# Altium schematic sheet MCU.SchDoc
size B; SheetNumber: 3; SheetTotal: 8
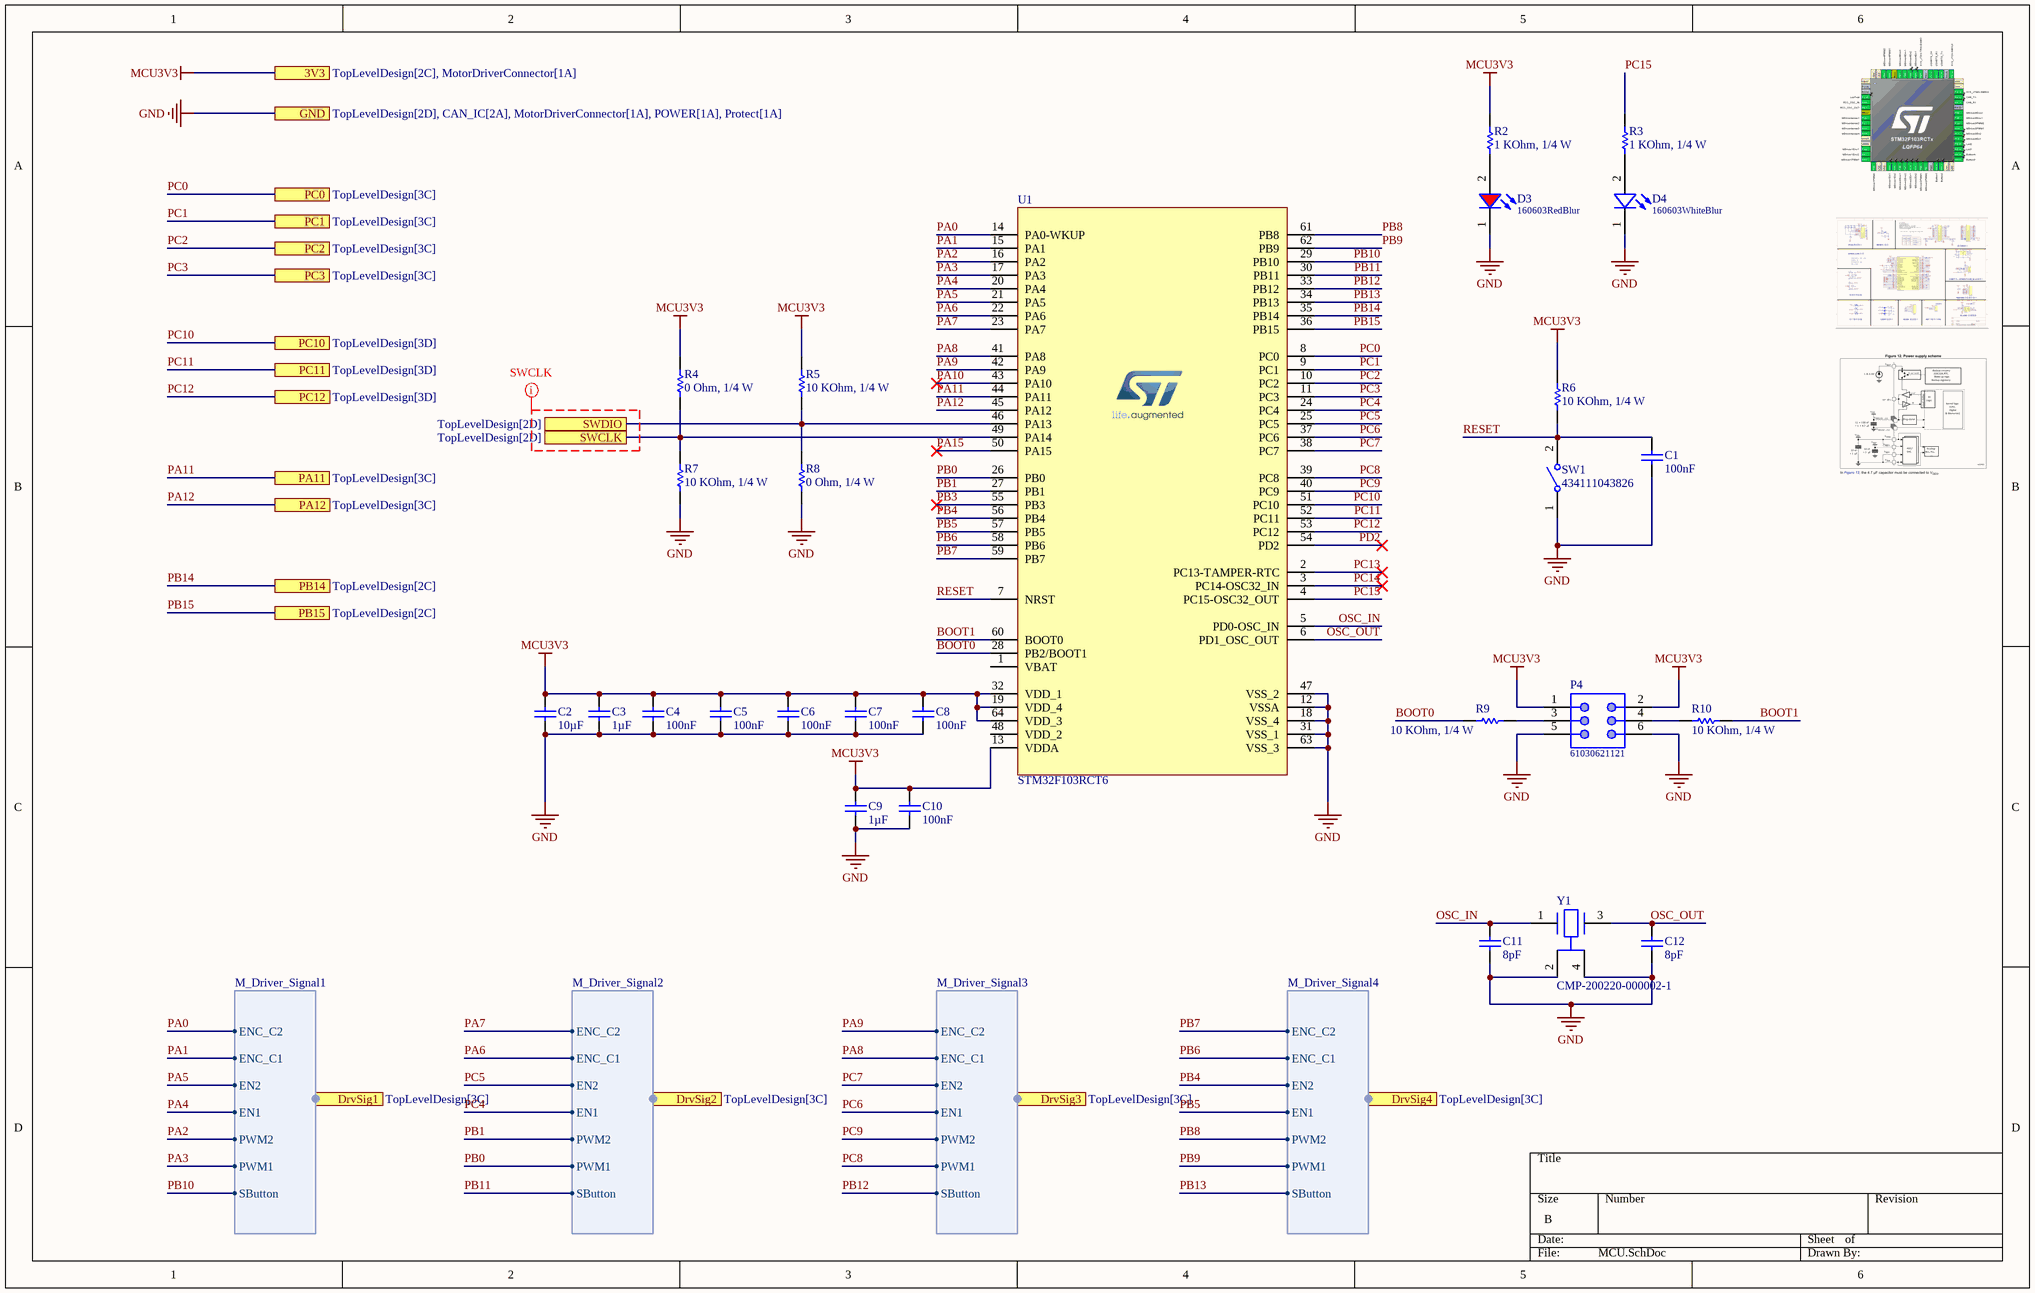
[diagram p0: MCU.SchDoc]

## Parts
C1  value 100nF  [CAP_0603]  (hidden comment: 0106031041050)
C2  value 10µF  [CAP_0603]  (hidden comment: 0106031061010)
C3  value 1µF  [CAP_0603]  (hidden comment: 0106031051016)
C4  value 100nF  [CAP_0603]  (hidden comment: 0106031041050)
C5  value 100nF  [CAP_0603]  (hidden comment: 0106031041050)
C6  value 100nF  [CAP_0603]  (hidden comment: 0106031041050)
C7  value 100nF  [CAP_0603]  (hidden comment: 0106031041050)
C8  value 100nF  [CAP_0603]  (hidden comment: 0106031041050)
C9  value 1µF  [CAP_0603]  (hidden comment: 0106031051016)
C10  value 100nF  [CAP_0603]  (hidden comment: 0106031041050)
C11  value 8pF  [CAP_0603]  (hidden comment: 0106030800550)
C12  value 8pF  [CAP_0603]  (hidden comment: 0106030800550)
D3  160603RedBlur  [WL-SMCW_0603_H=0.7mm]
D4  160603WhiteBlur  [WL-SMCW_0603_H=0.7mm]
P4  61030621121  [61030621121]
R2  value 1 KOhm, 1/4 W  [resistor_0603]  (hidden comment: 0006031021)
R3  value 1 KOhm, 1/4 W  [resistor_0603]  (hidden comment: 0006031021)
R4  value 0 Ohm, 1/4 W  [resistor_0603]  (hidden comment: 0006030001)
R5  value 10 KOhm, 1/4 W  [resistor_0603]  (hidden comment: 0006031031)
R6  value 10 KOhm, 1/4 W  [resistor_0603]  (hidden comment: 0006031031)
R7  value 10 KOhm, 1/4 W  [resistor_0603]  (hidden comment: 0006031031)
R8  value 0 Ohm, 1/4 W  [resistor_0603]  (hidden comment: 0006030001)
R9  value 10 KOhm, 1/4 W  [resistor_0603]  (hidden comment: 0006031031)
R10  value 10 KOhm, 1/4 W  [resistor_0603]  (hidden comment: 0006031031)
SW1  434111043826  [WS-TASV_L6W3.5H4.3_4341x10438x6]
U1  STM32F103RCT6  [QFP50P1200X1200X160-64N]
Y1  CMP-200220-000002-1  [FP-NX3225SA-MFG]

## Ports
3V3 (see TopLevelDesign[2C], MotorDriverConnector[1A]), DrvSig1 (harness M_Driver_Signal1, see TopLevelDesign[3C]), DrvSig2 (harness M_Driver_Signal2, see TopLevelDesign[3C]), DrvSig3 (harness M_Driver_Signal3, see TopLevelDesign[3C]), DrvSig4 (harness M_Driver_Signal4, see TopLevelDesign[3C]), GND (see TopLevelDesign[2D], CAN_IC[2A], MotorDriverConnector[1A], POWER[1A], Protect[1A]), PA11 (see TopLevelDesign[3C]), PA12 (see TopLevelDesign[3C]), PB14 (see TopLevelDesign[2C]), PB15 (see TopLevelDesign[2C]), PC0 (see TopLevelDesign[3C]), PC1 (see TopLevelDesign[3C]), PC2 (see TopLevelDesign[3C]), PC3 (see TopLevelDesign[3C]), PC10 (see TopLevelDesign[3D]), PC11 (see TopLevelDesign[3D]), PC12 (see TopLevelDesign[3D]), SWCLK (see TopLevelDesign[2D]), SWDIO (see TopLevelDesign[2D])

## Harnesses
M_Driver_Signal1: ENC_C2, ENC_C1, EN2, EN1, PWM2, PWM1, SButton
M_Driver_Signal2: ENC_C2, ENC_C1, EN2, EN1, PWM2, PWM1, SButton
M_Driver_Signal3: ENC_C2, ENC_C1, EN2, EN1, PWM2, PWM1, SButton
M_Driver_Signal4: ENC_C2, ENC_C1, EN2, EN1, PWM2, PWM1, SButton

## Nets
GND: C1.1 C2.1 C3.1 C4.1 C5.1 C6.1 C7.1 C8.1 C9.1 C10.1 C11.1 C12.1 D3.1(K) D4.1(K) P4.5 P4.6 R7.1 R8.1 SW1.1 U1.12(VSSA) U1.18(VSS_4) U1.31(VSS_1) U1.47(VSS_2) U1.63(VSS_3) Y1.2(GND) Y1.4(GND) ; port GND
MCU3V3: C2.2 C3.2 C4.2 C5.2 C6.2 C7.2 C8.2 C9.2 C10.2 P4.1 P4.2 R2.2 R4.2 R5.2 R6.2 U1.13(VDDA) U1.19(VDD_4) U1.32(VDD_1) U1.64(VDD_3) ; port 3V3
BOOT0: R9.1 U1.28(PB2/BOOT1)
BOOT1: R10.1 U1.60(BOOT0)
OSC_IN: C11.2 U1.5(PD0-OSC_IN) Y1.1
OSC_OUT: C12.2 U1.6(PD1_OSC_OUT) Y1.3
PA0: U1.14(PA0-WKUP) ; port DrvSig1.ENC_C2
PA1: U1.15(PA1) ; port DrvSig1.ENC_C1
PA2: U1.16(PA2) ; port DrvSig1.PWM2
PA3: U1.17(PA3) ; port DrvSig1.PWM1
PA4: U1.20(PA4) ; port DrvSig1.EN1
PA5: U1.21(PA5) ; port DrvSig1.EN2
PA6: U1.22(PA6) ; port DrvSig2.ENC_C1
PA7: U1.23(PA7) ; port DrvSig2.ENC_C2
PA8: U1.41(PA8) ; port DrvSig3.ENC_C1
PA9: U1.42(PA9) ; port DrvSig3.ENC_C2
PA10: U1.43(PA10)
PA11: U1.44(PA11) ; port PA11
PA12: U1.45(PA12) ; port PA12
PA15: U1.50(PA15)
PB0: U1.26(PB0) ; port DrvSig2.PWM1
PB1: U1.27(PB1) ; port DrvSig2.PWM2
PB3: U1.55(PB3)
PB4: U1.56(PB4) ; port DrvSig4.EN2
PB5: U1.57(PB5) ; port DrvSig4.EN1
PB6: U1.58(PB6) ; port DrvSig4.ENC_C1
PB7: U1.59(PB7) ; port DrvSig4.ENC_C2
PB8: U1.61(PB8) ; port DrvSig4.PWM2
PB9: U1.62(PB9) ; port DrvSig4.PWM1
PB10: U1.29(PB10) ; port DrvSig1.SButton
PB11: U1.30(PB11) ; port DrvSig2.SButton
PB12: U1.33(PB12) ; port DrvSig3.SButton
PB13: U1.34(PB13) ; port DrvSig4.SButton
PB14: U1.35(PB14) ; port PB14
PB15: U1.36(PB15) ; port PB15
PC0: U1.8(PC0) ; port PC0
PC1: U1.9(PC1) ; port PC1
PC2: U1.10(PC2) ; port PC2
PC3: U1.11(PC3) ; port PC3
PC4: U1.24(PC4) ; port DrvSig2.EN1
PC5: U1.25(PC5) ; port DrvSig2.EN2
PC6: U1.37(PC6) ; port DrvSig3.EN1
PC7: U1.38(PC7) ; port DrvSig3.EN2
PC8: U1.39(PC8) ; port DrvSig3.PWM1
PC9: U1.40(PC9) ; port DrvSig3.PWM2
PC10: U1.51(PC10) ; port PC10
PC11: U1.52(PC11) ; port PC11
PC12: U1.53(PC12) ; port PC12
PC13: U1.2(PC13-TAMPER-RTC)
PC14: U1.3(PC14-OSC32_IN)
PC15: R3.2 U1.4(PC15-OSC32_OUT)
PD2: U1.54(PD2)
RESET: C1.2 R6.1 SW1.2 U1.7(NRST)
SWCLK: R4.1 R7.2 U1.49(PA14) ; port SWCLK
SWDIO: R5.1 R8.2 U1.46(PA13) ; port SWDIO
NetD3_2: D3.2(A) R2.1
NetD4_2: D4.2(A) R3.1
NetP4_3: P4.3 R9.2
NetP4_4: P4.4 R10.2

Not connected (* = marked no-connect by the designer): U1 1(VBAT) 48(VDD_2)

## Layout directives
rule Matched Net Lengths [Delay Tolerance = 10ps]: (no net found under the mark)

## Library data of the parts
C1 C4-C8 C10 = CMP-001-00214-1: CAP, size 0603, 100 nF, 50 VDC; Manufacture SN: CGA3E3X8R1H104K080AE; Manufacture Name: TDK; Tolerance: 10%; Voltage Rating DC: 50 VDC; Supplier 2 Name: Digi-Key; Pins: 2; Supplier 3 Name: thegioiic; Design Item ID: 0106031041050; Supplier 1 Name: Mouser; Supplier 1 URL: https://www.mouser.com/ProductDetail/TDK/CGA3E3X8R1H104K080AE?qs=nQSIdc08i%252Bd8g3IRRgU2bw%3D%3D&utm_source=mouser-refine-download&utm_medium=file&utm_campaign=CGA3E3X8R1H104K080AE&utm_content=TDK; Size: 0603; Supplier 2 URL: https://www.digikey.com/en/products/detail/tdk-corporation/cga3e3x8r1h104k080ae/5809262; Operating Temperature: -55 to +125degC; Packaging: Tape and Reel; Source: Capacitor_0603_10_percent.SchLib; Supplier 1 SN: 810-CGA3E3X8R1H104KA; Supplier 3 SN: N/A; Supplier 2 SN: 445-173697-2-ND; Mounting Technology: SMT; Supplier 3 URL: N/A; Component Type: Standard
C2 = CMP-001-00219-1: CAP, size 0603, 10 uF, 10 VDC; Manufacture Name: Samsung Electro-Mechanics; Manufacture SN: CL10A106KP8NNWC; Voltage Rating DC: 10 VDC; Tolerance: 10%; Supplier 3 Name: thegioiic; Supplier 2 Name: Digi-Key; Design Item ID: 0106031061010; Size: 0603; Packaging: Tape and Reel; Supplier 1 URL: https://www.mouser.vn/ProductDetail/Samsung-Electro-Mechanics/CL10A106KP8NNWC?qs=xZ%2FP%252Ba9zWqZx8LSX23YqWA%3D%3D&utm_source=mouser-refine-download&utm_medium=file&utm_campaign=CL10A106KP8NNWC&utm_content=Samsung-Electro-Mechanics; Supplier 3 SN: N/A; Component Type: Standard; Supplier 2 SN: 1276-CL10A106KP8NNWCTR-ND; Supplier 1 Name: Mouser; Supplier 2 URL: https://www.digikey.com/en/products/detail/samsung-electro-mechanics/cl10a106kp8nnwc/16572907; Source: Capacitor_0603_10_percent.SchLib; Supplier 3 URL: https://www.thegioiic.com/tu-gom-0603-10uf-25v; Pins: 2; Supplier 1 SN: 187-CL10A106KP8NNWC; Operating Temperature: -55 to +125degC; Mounting Technology: SMT
C3 C9 = CMP-001-00215-1: CAP, size 0603, 1 uF, 16 VDC; Manufacture Name: Samsung Electro-Mechanics; Manufacture SN: CL10B105KO8NNWC; Voltage Rating DC: 16 VDC; Tolerance: 10%; Supplier 3 Name: thegioiic; Operating Temperature: -55 to +125degC; Supplier 2 URL: https://www.digikey.com/en/products/detail/samsung-electro-mechanics/cl10b105ko8nnwc/16572783; Supplier 1 Name: Mouser; Supplier 2 Name: Digi-Key; Component Type: Standard; Source: Capacitor_0603_10_percent.SchLib; Packaging: Tape and Reel; Mounting Technology: SMT; Supplier 2 SN: 1276-CL10B105KO8NNWCTR-ND; Size: 0603; Pins: 2; Supplier 1 URL: https://www.mouser.vn/ProductDetail/Samsung-Electro-Mechanics/CL10B105KO8NNWC?qs=81r%252BiQLm7BT%252BXtc72qn1ug%3D%3D&utm_source=mouser-refine-download&utm_medium=file&utm_campaign=CL10B105KO8NNWC&utm_content=Samsung-Electro-Mechanics; Supplier 3 SN: N/A; Supplier 1 SN: 187-CL10B105KO8NNWC; Design Item ID: 0106031051016; Supplier 3 URL: https://www.thegioiic.com/tu-gom-0603-1uf-16v
C11 C12 = CMP-001-00207-1: CAP, size 0603, 8 pF, 50 VDC; Manufacture Name: TDK; Manufacture SN: CGA3E2NP01H060D080AA; Tolerance: 5%; Voltage Rating DC: 50 VDC; Supplier 2 URL: https://www.digikey.com/en/products/detail/tdk-corporation/cga3e2np01h060d080aa/3949663; Component Type: Standard; Mounting Technology: SMT; Supplier 1 URL: https://www.mouser.com/ProductDetail/TDK/CGA3E2NP01H060D080AA?qs=xLDY6iXSiQboN%2F6my%2FnNkQ%3D%3D&utm_source=mouser-refine-download&utm_medium=file&utm_campaign=CGA3E2NP01H060D080AA&utm_content=TDK; Supplier 3 Name: thegioiic; Supplier 2 SN: 445-12427-2-ND; Packaging: Tape and Reel; Supplier 1 SN: 810-CGA3E2NP01H060DA; Supplier 2 Name: Digi-Key; Operating Temperature: -55 to +125degC; Source: Capacitor_0603_5_percent.SchLib; Supplier 1 Name: Mouser; Design Item ID: 0106030600550; Supplier 3 URL: N/A; Size: 0603; Pins: 2; Supplier 3 SN: N/A
D3 = CMP-004-00093-1: WL-SMCW SMT Mono-color Chip LED Blur, size 0603, Red, 2V, 140deg; Value: Red, 2V; ComponentLink2URL: https://www.mouser.vn/ProductDetail/ROHM-Semiconductor/CSL1901VW1?qs=vvQtp7zwQdNmrXZcE27xEA%3D%3D; Supplier 2 URL: https://www.digikey.com/en/products/detail/rohm-semiconductor/SML-D12U8WT86/1641799; Pins: 2; Supplier 2 Name: Digi-Key; ComponentLink1Description: Datasheet link; ComponentLink3URL: https://www.digikey.com/en/products/detail/rohm-semiconductor/SML-D12U8WT86/1641799; Supplier 1 Name: Mouser; Supplier 1 SN: 755-CSL1901VW1; Size: 0603; ComponentLink1URL: N/A; Source: WL-SMCW_0603.SchLib; ComponentLink3Description: Supplier 2 URL; Type: Blur; Design Item ID: 160603RedBlur; Component Type: Standard; ComponentLink4URL: N/A; Supplier 3 Name: ICDayRoi; Supplier 3 SN: N/A; Color: Red; Supplier 1 URL: https://www.mouser.vn/ProductDetail/ROHM-Semiconductor/CSL1901VW1?qs=vvQtp7zwQdNmrXZcE27xEA%3D%3D; Supplier 2 SN: 511-1580-2-ND; ComponentLink2Description: Supplier 1 URL; Supplier 3 URL: N/A; ComponentLink4Description: Supplier 3 URL
D4 = CMP-004-00095-1: WL-SMCW SMT Mono-color Chip LED Blur, size 0603, White; ComponentLink3Description: Supplier 2 URL; Design Item ID: 160603WhiteBlur; Component Type: Standard; Size: 0603; Supplier 1 SN: 755-SMLEN3WBC8W1; Color: White; Supplier 3 Name: ICDayRoi; Supplier 3 URL: N/A; Pins: 2; Supplier 2 URL: https://www.digikey.com/en/products/detail/qt-brightek-qtb/QBLP601-IW/4814655; ComponentLink1URL: N/A; ComponentLink3URL: https://www.digikey.com/en/products/detail/qt-brightek-qtb/QBLP601-IW/4814655; Supplier 1 URL: https://www.mouser.vn/ProductDetail/ROHM-Semiconductor/SMLEN3WBC8W1?qs=W0yvOO0ixfGun78rr9Unsw%3D%3D; ComponentLink2URL: https://www.mouser.vn/ProductDetail/ROHM-Semiconductor/SMLEN3WBC8W1?qs=W0yvOO0ixfGun78rr9Unsw%3D%3D; ComponentLink4Description: Supplier 3 URL; Supplier 1 Name: Mouser; Supplier 3 SN: N/A; ComponentLink4URL: N/A; Source: WL-SMCW_0603.SchLib; Supplier 2 SN: 1516-1057-2-ND; Value: White; Supplier 2 Name: Digi-Key; ComponentLink2Description: Supplier 1 URL; ComponentLink1Description: Datasheet link; Type: Blur
P4 = CMP-002-00439-1: WR-PHD Pin Header, SMT, pitch 2.54mm, Dual Row, Vertical, 6p; Manufacturer: Wurth Elektronik; Working Voltage: 250VAC; Rated Current: 3A; Withstanding Voltage: 500VAC; Supply name 1: Mouser; Contact Resistance: 20mOhm; Pin Number: 6; Source: WR-PHD_Pin Header_2.54mm.SchLib; Supplier 2 SN: N/A; Supplier 1 SN: 710-61000621121; Pitch: 2.54mm; Design Item ID: 61030621121; ComponentLink4URL: https://www.mouser.vn/ProductDetail/Wurth-Elektronik/61030621121?qs=PhR8RmCirEbl%2F20%2FFLRJRA%3D%3D; ComponentLink4Description: Global Supply; Row Number: Dual; Supplier 2 URL: N/A; Pins: 6; Supplier 3 SN: N/A; Manufacturer Part Number: 61030621121; Supplier 2 Name: Digi-Key; ComponentLink2Description: Datasheet; ComponentLink1URL: http://www.we-online.de; Packaging: Tape and Reel; Supplier 3 Name: thegioiic; Published Date: May 2020; Supplier 1 URL: https://www.mouser.vn/ProductDetail/Wurth-Elektronik/61000621121?qs=PhR8RmCirEYoFU9UUO%252Bbug%3D%3D; ComponentLink3URL: https://www.we-online.com/en/components/products/PHD_2_54_SMT_DUAL_PIN_HEADER_6100XX21121?sq=61030621121#61030621121; Mounting Technology: SMT; ComponentLink2URL: https://www.we-online.com/catalog/datasheet/61030621121.pdf; Orientation: Vertical; ComponentLink3Description: Global Supply; Component Type: Standard; ComponentLink1Description: Manufacturer; Supplier 1 Name: Mouser; Gender: Pin Header; Supplier 3 URL: N/A; Operating Temperature: -40 to +125degC
R2 R3 = CMP-009-00186-1: RES, size 0603, 1 KOhm, 1/4 W; Manufacture  SN: OEM; Rated Power: 1/4 W; Resistance Tolerance: +/-1%; Supplier 1 SN: 71-RCS06031K00FKEA; ComponentLink4Description: Supplier 3 URL; ComponentLink2Description: Supplier 1 URL; Supplier 3 SN: N/A; Supplier 2 Name: Digi-Key; ComponentLink3Description: Supplier 2 URL; Pins: 2; ComponentLink4URL: N/A; Source: Resistor_0603.SchLib; ComponentLink3URL: https://www.digikey.com/en/products/detail/yageo/SR0603FR-7T1KL/9373103; Supplier 2 SN: YAG5829TR-ND YAG5829CT-ND YAG5829DKR-ND; Supplier 2 URL: https://www.digikey.com/en/products/detail/yageo/SR0603FR-7T1KL/9373103; Supplier 1 Name: Mouser; Component Type: Standard; ComponentLink2URL: N/A; Size: 0603; Supplier 1 URL: https://www.mouser.vn/ProductDetail/Vishay-Dale/RCS06031K00FKEA?qs=sGAEpiMZZMvdGkrng054t9clqp6gtJJdzI9PGMrTQi4RTIuHToNahw%3D%3D; Supplier 3 URL: N/A; Design Item ID: 0006031021; Mounting Technology: SMT; ComponentLink1URL: https://www.yageo.com/upload/media/product/productsearch/datasheet/rchip/PYu-SR_20105_RoHS_L_10.pdf; ComponentLink1Description: Datasheet link; Supplier 3 Name: thegioiic; Manufacture  Name: OEM
R4 R8 = CMP-009-00180-1: RES, size 0603, 0 Ohm, 1/4 W; Manufacture  Name: YAGEO; Manufacture  SN: AC0603FR-070RL; Resistance Tolerance: +/-1%; Rated Power: 1/4 W; Pins: 2; ComponentLink1Description: Datasheet link; ComponentLink4URL: N/A; Component Type: Standard; ComponentLink2URL: N/A; Supplier 2 URL: https://www.digikey.com/en/products/detail/yageo/ac0603fr-070rl/2827812; Supplier 1 Name: Mouser; Supplier 1 SN: 603-AC0603FR-070RL; ComponentLink1URL: https://www.mouser.com/datasheet/2/447/Yageo_06282023_ACseries-3224032.pdf; Mounting Technology: SMT; ComponentLink2Description: Supplier 1 URL; Size: 0603; Supplier 2 SN: 311-0.0LDTR-ND; ComponentLink4Description: Supplier 3 URL; ComponentLink3URL: https://www.digikey.com/en/products/detail/yageo/ac0603fr-070rl/2827812; ComponentLink3Description: Supplier 2 URL; Supplier 3 Name: thegioiic; Supplier 3 SN: N/A; Supplier 2 Name: Digi-Key; Source: Resistor_0603.SchLib; Design Item ID: 0006030001; Supplier 3 URL: https://www.thegioiic.com/dien-tro-0-ohm-0603-1-; Supplier 1 URL: https://www.mouser.com/ProductDetail/YAGEO/AC0603FR-070RL?qs=sGAEpiMZZMtlubZbdhIBIOG3KwTtqrl%2FD2D%252BGuMCfoY%3D
R5-R7 R9 R10 = CMP-009-00188-1: RES, size 0603, 10 KOhm, 1/4 W; Manufacture  Name: OEM; Rated Power: 1/4 W; Resistance Tolerance: +/-1%; ComponentLink1Description: Datasheet link; Size: 0603; Supplier 2 SN: RHM10KADTR-ND RHM10KADCT-ND RHM10KADDKR-ND; Mounting Technology: SMT; ComponentLink2URL: N/A; Design Item ID: 0006031031; Supplier 1 Name: Mouser; Component Type: Standard; Supplier 2 URL: https://www.digikey.com/en/products/detail/rohm-semiconductor/ESR03EZPF1002/1983429; Manufacture  SN: OEM; Supplier 2 Name: Digi-Key; Supplier 3 URL: N/A; Source: Resistor_0603.SchLib; ComponentLink1URL: https://fscdn.rohm.com/en/products/databook/datasheet/passive/resistor/chip_resistor/esr-e.pdf; Pins: 2; ComponentLink3Description: Supplier 2 URL; Supplier 1 URL: https://www.mouser.vn/ProductDetail/ROHM-Semiconductor/ESR03EZPF1002?qs=sGAEpiMZZMvdGkrng054t67Efho1F8r6CDeAsqwFse8%3D; Supplier 1 SN: 755-ESR03EZPF1002; Supplier 3 SN: N/A; ComponentLink3URL: https://www.digikey.com/en/products/detail/rohm-semiconductor/ESR03EZPF1002/1983429; ComponentLink4Description: Supplier 3 URL; Supplier 3 Name: thegioiic; ComponentLink2Description: Supplier 1 URL; ComponentLink4URL: N/A
SW1 = CMP-011-00107-1: WS-TASV SMT Tact Switch, L6 x W3.5 x H4.3mm, 260g, SPST-NO, 12V, 50mA; Manufacturer: Wurth Elektronik; Washable: No; Rated Voltage: 12VDC; Packaging: Tape and Reel; Pins: 2; Category: Tact Switches; Width: 3.5mm; Length: 6mm; Design Item ID: 434111043826; Mount: Surface Mount; Supplier 2 URL: https://www.digikey.com/en/products/detail/w%C3%BCrth-elektronik/434111043826/5209073; Operating Temperature Min: -40°C; Circuit: SPST-NO; Supplier 1 URL: https://www.mouser.vn/ProductDetail/Wurth-Elektronik/434111043826?qs=wr8lucFkNMW3koBfPj4qpQ%3D%3D; Rated Current: 50mA; Supplier 3 SN: N/A; Supplier 1 SN: 710-434111043826; Operation Force: 260g; Supplier 3 Name: Thegioiic; Terminal Material: Copper Alloy; Height: 4.3mm; Component Type: Standard; Supplier 2 SN: 732-7040-2-ND; Supplier 3 URL: N/A; Match Code: WS-TASV; Terminal Plating: Silver; Operating Temperature Max: 85°C; Source: Button.SchLib; Supplier 2 Name: Digi-Key; Manufacturer Part Number: 434111043826; Contact Material: Stainless Steel; Supplier 1 Name: Mouser
U1 = CMP-031-00016-5: ARMÂ® CortexÂ®-M3 STM32F1 Microcontroller IC 32-Bit 72MHz 256KB (256K x 8) FLASH 64-LQFP (10x10); MF: STMicroelectronics; Design Item ID: STM32F103RCT6; Pins: 64; Case/Package: LQFP-64 STMicroelectronics; Price: None; Component Type: Standard; Check_prices: https://www.snapeda.com/parts/STM32F103RCT6/STMicroelectronics/view-part/?ref=eda; MP: STM32F103RCT6; SnapEDA_Link: https://www.snapeda.com/parts/STM32F103RCT6/STMicroelectronics/view-part/?ref=snap; Source: STM32F103RCT6.SchLib; Value: *; Availability: In Stock; Purchase-URL: https://pricing.snapeda.com/search/part/STM32F103RCT6/?ref=eda
Y1 = CMP-003-00057-1: CRYSTAL 8.000MHZ 8PF SMD; Manufacturer: NDK; Manufacturer Part Number: NX3225SA-25.000M-STD-CRS-2; Esr: 100; Tolerance: 15ppm; Automotive Grade: Grade 1; Frequency: 25MHz; Load Capacitance: 8pF; Octopart: https://octopart.com/nx3225sa-25.000m-std-crs-2-ndk-51374293; Temperature: -40°C to +125°C; Category: Crys; Source: Components - 28.03.25 - 23.15.SchLib; Component Type: Standard; Lead Free: Yes; Pins: 4; Case/Package: NX3225SA; Temperature Range Low: -40°C; Device Class L3: Crystals; Series: NX3225SA; RoHS: TRUE; Design Item ID: CMP-200220-000002-1; Height: 0.6mm; Automotive: Yes; Device Class L1: Passive Components; Temperature Range High: 125°C; Digikey Description: CRYSTAL 25.0000MHZ 8PF SMD; Device Class L2: Crystals / Oscillators